# Altium project Umgebungssensor_PCB.PrjPcb
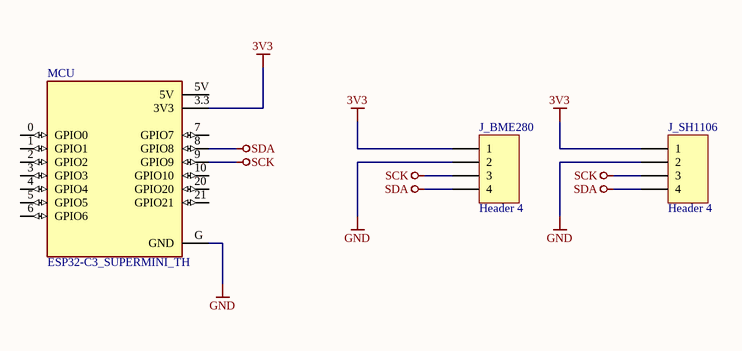
[diagram p0: Umgebungssensor_PCB.SchDoc]
1 sheet, 3 parts. Net scope: global (net labels, ports and power ports of the same name join across sheets).
Board file: Umgebungssensor_PCB.PcbDoc

## Sheet Umgebungssensor_PCB.SchDoc
size A4; DocumentNumber: 1; Revision: 0.1; SheetNumber: 1; SheetTotal: 1; HTL_Gruppe: C; HTL_Klasse: 4AHEL; HTL_Zusaetzlicher_Titel: mit ESP32-C3 SuperMini; HTL_Schueler_Name: Valentin Stadelwieser; ErikTóth; PageSetup: Record=PageOptions|CenterHorizontal=True|CenterVertical=True|PrintScale=1.00|XCorrection=1.00|YCorrection=1.00|PrintKind=0|BorderSize=5000000|LeftOffset=0|BottomOffset=0|Orientation=2|PaperLength=1000|PaperWidth=1000|Scale=100|PaperSource=7|PrintQuality=-4|MediaType=1|DitherType=10|PaperKind=A4|PrintScaleMode=1; HTL_Projektname: Umgebungssensor; HTL_Dokumentenart: Schematic; HTL_Dokumentenstatus: Prototyp

### Parts
J_BME280  Header 4  [HDR1X4]
J_SH1106  Header 4  [HDR1X4]
MCU  ESP32-C3_SUPERMINI_TH  [MODULE_ESP32-C3_SUPERMINI]

### Nets
3V3: J_BME280.1 J_SH1106.1 MCU.3.3(3V3)
GND: J_BME280.2 J_SH1106.2 MCU.G(GND)
SCK: J_BME280.3 J_SH1106.3 MCU.9(GPIO9)
SDA: J_BME280.4 J_SH1106.4 MCU.8(GPIO8)

Not connected (* = marked no-connect by the designer): MCU 0(GPIO0) 1(GPIO1) 2(GPIO2) 3(GPIO3) 4(GPIO4) 5(GPIO5) 5V 6(GPIO6) 7(GPIO7) 10(GPIO10) 20(GPIO20) 21(GPIO21)

### Notes on the sheet
- Sachnummer / Dateiname:
- Name:
- Gruppe:
- Klasse:
- Elektronik &
- Technische Informatik
- Anichstraße 26 - 28
- HTBLVA
- Titel:
- Datum:
- Dokumentenart:
- Dokumentenstatus:
- A - 6020 Innsbruck
- Ver.:
- Blatt:
- Blätter:

### Library data of the parts
J_BME280 J_SH1106 = Header 4: Header, 4-Pin; LatestRevisionDate: 17-Jul-2002; LatestRevisionNote: Re-released for DXP Platform.; Publisher: Altium Limited
MCU = ESP32-C3_SUPERMINI_TH: Super tiny ESP32-C3 board; MF: Espressif Systems; MP: ESP32-C3 SuperMini_TH; SnapEDA_Link: https://www.snapeda.com/parts/ESP32-C3%20SuperMini_TH/Espressif+Systems/view-part/?ref=snap; Package: Package; Value: *; Check_prices: https://www.snapeda.com/parts/ESP32-C3%20SuperMini_TH/Espressif+Systems/view-part/?ref=eda